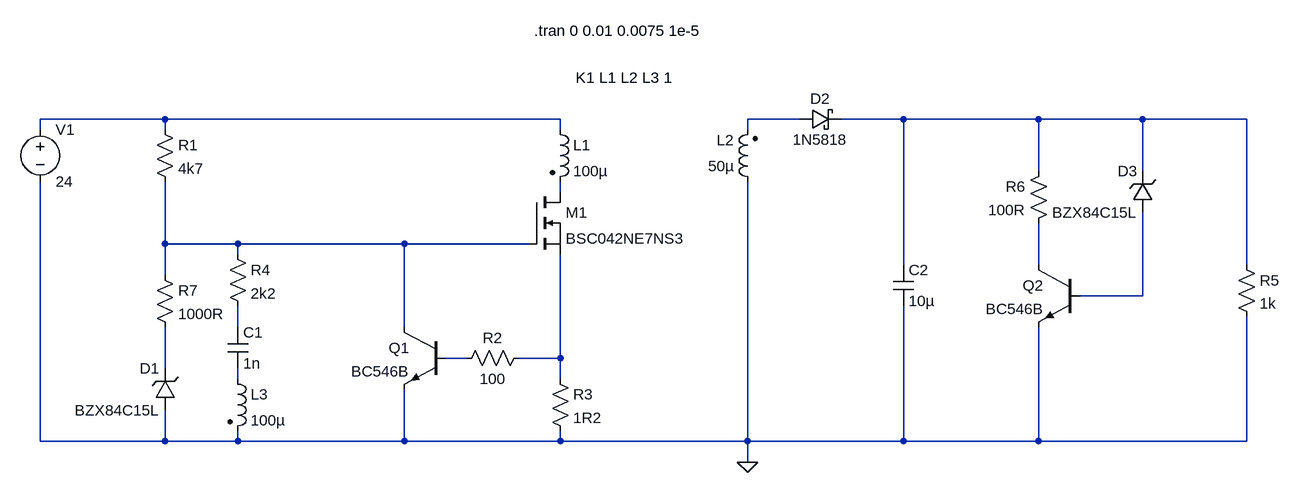
[diagram p0: schematic flyback.asc]
flyback.asc, the LTspice schematic file:
Version 4
SHEET 1 2004 680
WIRE 240 112 48 112
WIRE 848 112 240 112
WIRE 1216 112 1136 112
WIRE 1376 112 1280 112
WIRE 1584 112 1376 112
WIRE 1744 112 1584 112
WIRE 1904 112 1744 112
WIRE 48 128 48 112
WIRE 240 128 240 112
WIRE 848 128 848 112
WIRE 1136 128 1136 112
WIRE 1584 192 1584 112
WIRE 1744 192 1744 112
WIRE 848 224 848 208
WIRE 240 304 240 208
WIRE 352 304 240 304
WIRE 608 304 352 304
WIRE 800 304 608 304
WIRE 352 320 352 304
WIRE 1376 336 1376 112
WIRE 1584 336 1584 272
WIRE 1904 336 1904 112
WIRE 240 352 240 304
WIRE 1744 384 1744 256
WIRE 1744 384 1648 384
WIRE 352 432 352 400
WIRE 608 432 608 304
WIRE 704 480 672 480
WIRE 848 480 848 320
WIRE 848 480 784 480
WIRE 240 496 240 432
WIRE 352 512 352 496
WIRE 848 512 848 480
WIRE 48 608 48 208
WIRE 240 608 240 560
WIRE 240 608 48 608
WIRE 352 608 352 592
WIRE 352 608 240 608
WIRE 608 608 608 528
WIRE 608 608 352 608
WIRE 848 608 848 592
WIRE 848 608 608 608
WIRE 1136 608 1136 208
WIRE 1136 608 848 608
WIRE 1376 608 1376 400
WIRE 1376 608 1136 608
WIRE 1584 608 1584 432
WIRE 1584 608 1376 608
WIRE 1904 608 1904 416
WIRE 1904 608 1584 608
WIRE 1136 640 1136 608
FLAG 1136 640 0
SYMBOL voltage 48 112 R0
WINDOW 123 0 0 Left 0
WINDOW 39 0 0 Left 0
SYMATTR InstName V1
SYMATTR Value 24
SYMBOL res 224 112 R0
SYMATTR InstName R1
SYMATTR Value 4k7
SYMBOL zener 256 560 R180
WINDOW 0 24 64 Left 2
WINDOW 3 24 0 Left 2
SYMATTR InstName D1
SYMATTR Value BZX84C15L
SYMATTR Description Diode
SYMATTR Type diode
SYMBOL npn 672 432 M0
SYMATTR InstName Q1
SYMATTR Value BC546B
SYMBOL nmos 800 224 R0
SYMATTR InstName M1
SYMATTR Value BSC042NE7NS3
SYMBOL res 800 464 R90
WINDOW 0 0 56 VBottom 2
WINDOW 3 32 56 VTop 2
SYMATTR InstName R2
SYMATTR Value 100
SYMBOL res 832 496 R0
SYMATTR InstName R3
SYMATTR Value 1R2
SYMBOL ind2 832 112 R0
SYMATTR InstName L1
SYMATTR Value 100µ
SYMATTR Type ind
SYMBOL ind2 1152 224 R180
WINDOW 0 36 80 Left 2
WINDOW 3 36 40 Left 2
SYMATTR InstName L2
SYMATTR Value 50µ
SYMATTR Type ind
SYMBOL schottky 1216 128 R270
WINDOW 0 32 32 VTop 2
WINDOW 3 0 32 VBottom 2
SYMATTR InstName D2
SYMATTR Value 1N5818
SYMATTR Description Diode
SYMATTR Type diode
SYMBOL ind2 336 496 R0
SYMATTR InstName L3
SYMATTR Value 100µ
SYMATTR Type ind
SYMBOL cap 336 432 R0
SYMATTR InstName C1
SYMATTR Value 1n
SYMBOL res 336 304 R0
SYMATTR InstName R4
SYMATTR Value 2k2
SYMBOL cap 1360 336 R0
SYMATTR InstName C2
SYMATTR Value 10µ
SYMBOL zener 1760 256 R180
WINDOW 0 24 64 Left 2
WINDOW 3 24 0 Left 2
SYMATTR InstName D3
SYMATTR Value BZX84C15L
SYMATTR Description Diode
SYMATTR Type diode
SYMBOL npn 1648 336 M0
SYMATTR InstName Q2
SYMATTR Value BC546B
SYMBOL res 1888 320 R0
SYMATTR InstName R5
SYMATTR Value 1k
SYMBOL res 1600 176 M0
SYMATTR InstName R6
SYMATTR Value 100R
SYMBOL res 224 336 R0
SYMATTR InstName R7
SYMATTR Value 1000R
TEXT 872 48 Left 2 !K1 L1 L2 L3 1
TEXT 808 -24 Left 2 !.tran 0 0.01 0.0075 1e-5

The netlist it stands for:
* flyback.asc
V1 N001 0 24
R1 N001 N005 4k7
D1 0 N011 BZX84C15L
Q1 N005 N009 0 0 BC546B
M1 N004 N005 N010 N010 BSC042NE7NS3
R2 N010 N009 100
R3 N010 0 1R2
L1 N001 N004 100µ
L2 0 N002 50µ
D2 N002 N003 1N5818
L3 N012 0 100µ
C1 N008 N012 1n
R4 N005 N008 2k2
C2 N003 0 10µ
D3 N007 N003 BZX84C15L
Q2 N006 N007 0 0 BC546B
R5 N003 0 1k
R6 N003 N006 100R
R7 N005 N011 1000R
.model D D
.lib standard.dio
.model NPN NPN
.model PNP PNP
.lib standard.bjt
.model NMOS NMOS
.model PMOS PMOS
.lib standard.mos
K1 L1 L2 L3 1
.tran 0 0.01 0.0075 1e-5
.backanno
.end